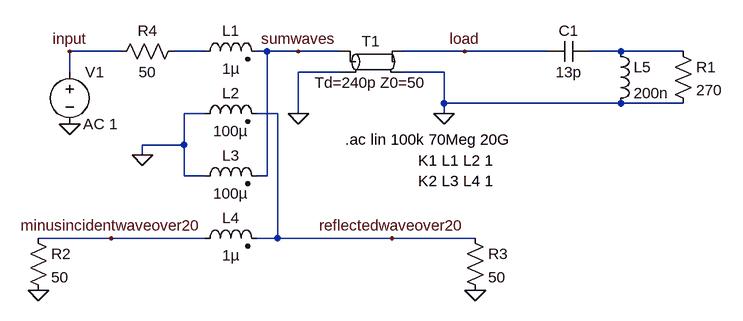
[diagram p0: schematic p3.lc_parasitic.asc]
p3.lc_parasitic.asc, the LTspice schematic file:
Version 4
SHEET 1 1028 680
WIRE 96 128 16 128
WIRE 224 128 176 128
WIRE 320 128 304 128
WIRE 368 128 320 128
WIRE 432 128 368 128
WIRE 624 128 528 128
WIRE 752 128 624 128
WIRE 864 128 816 128
WIRE 960 128 864 128
WIRE 16 160 16 128
WIRE 432 160 368 160
WIRE 592 160 528 160
WIRE 592 208 592 160
WIRE 864 208 592 208
WIRE 960 208 864 208
WIRE 224 224 192 224
WIRE 336 224 304 224
WIRE 368 224 368 160
WIRE 592 224 592 208
WIRE 192 272 192 224
WIRE 192 272 128 272
WIRE 128 288 128 272
WIRE 192 320 192 272
WIRE 224 320 192 320
WIRE 320 320 320 128
WIRE 320 320 304 320
WIRE 80 416 -32 416
WIRE 224 416 80 416
WIRE 336 416 336 224
WIRE 336 416 304 416
WIRE 512 416 336 416
WIRE 640 416 512 416
FLAG 16 240 0
FLAG 128 288 0
FLAG -32 496 0
FLAG 640 496 0
FLAG 592 224 0
FLAG 368 224 0
FLAG 16 128 input
FLAG 368 128 sumwaves
FLAG 624 128 load
FLAG 512 416 reflectedwaveover20
FLAG 80 416 minusincidentwaveover20
SYMBOL Res 192 112 R90
WINDOW 0 0 56 VBottom 2
WINDOW 3 32 56 VTop 2
SYMATTR InstName R4
SYMATTR Value 50
SYMBOL Voltage 16 144 R0
WINDOW 3 24 96 Invisible 2
WINDOW 123 21 96 Left 2
SYMATTR Value ""
SYMATTR Value2 AC 1
SYMATTR InstName V1
SYMBOL ind2 208 144 R270
WINDOW 0 32 56 VTop 2
WINDOW 3 5 56 VBottom 2
SYMATTR InstName L1
SYMATTR Value 1µ
SYMATTR Type ind
SYMBOL ind2 208 240 R270
WINDOW 0 32 56 VTop 2
WINDOW 3 5 56 VBottom 2
SYMATTR InstName L2
SYMATTR Value 100µ
SYMATTR Type ind
SYMBOL ind2 208 336 R270
WINDOW 0 32 56 VTop 2
WINDOW 3 5 56 VBottom 2
SYMATTR InstName L3
SYMATTR Value 100µ
SYMATTR Type ind
SYMBOL ind2 208 432 R270
WINDOW 0 32 56 VTop 2
WINDOW 3 5 56 VBottom 2
SYMATTR InstName L4
SYMATTR Value 1µ
SYMATTR Type ind
SYMBOL Res -48 400 R0
SYMATTR InstName R2
SYMATTR Value 50
SYMBOL Res 624 400 R0
SYMATTR InstName R3
SYMATTR Value 50
SYMBOL tline 480 144 R0
SYMATTR InstName T1
SYMATTR Value Td=240p Z0=50
SYMBOL Res 944 112 R0
SYMATTR InstName R1
SYMATTR Value 270
SYMBOL Ind 848 112 R0
SYMATTR InstName L5
SYMATTR Value 200n
SYMBOL Cap 816 112 R90
WINDOW 0 0 32 VBottom 2
WINDOW 3 32 32 VTop 2
SYMATTR InstName C1
SYMATTR Value 13p
TEXT 440 264 Left 2 !.ac lin 100k 70Meg 20G
TEXT 552 296 Left 2 !K1 L1 L2 1
TEXT 552 328 Left 2 !K2 L3 L4 1

The netlist it stands for:
* p3.lc_parasitic.asc
R4 N001 input 50
V1 input 0 AC 1
L1 N001 sumwaves 1µ
L2 0 reflectedwaveover20 100µ
L3 0 sumwaves 100µ
L4 minusincidentwaveover20 reflectedwaveover20 1µ
R2 minusincidentwaveover20 0 50
R3 reflectedwaveover20 0 50
T1 sumwaves 0 load 0 Td=240p Z0=50
R1 N002 0 270
L5 N002 0 200n
C1 N002 load 13p
.ac lin 100k 70Meg 20G
K1 L1 L2 1
K2 L3 L4 1
.backanno
.end